# EAGLE design Copter_Receiver (EAGLE 7.5.0)
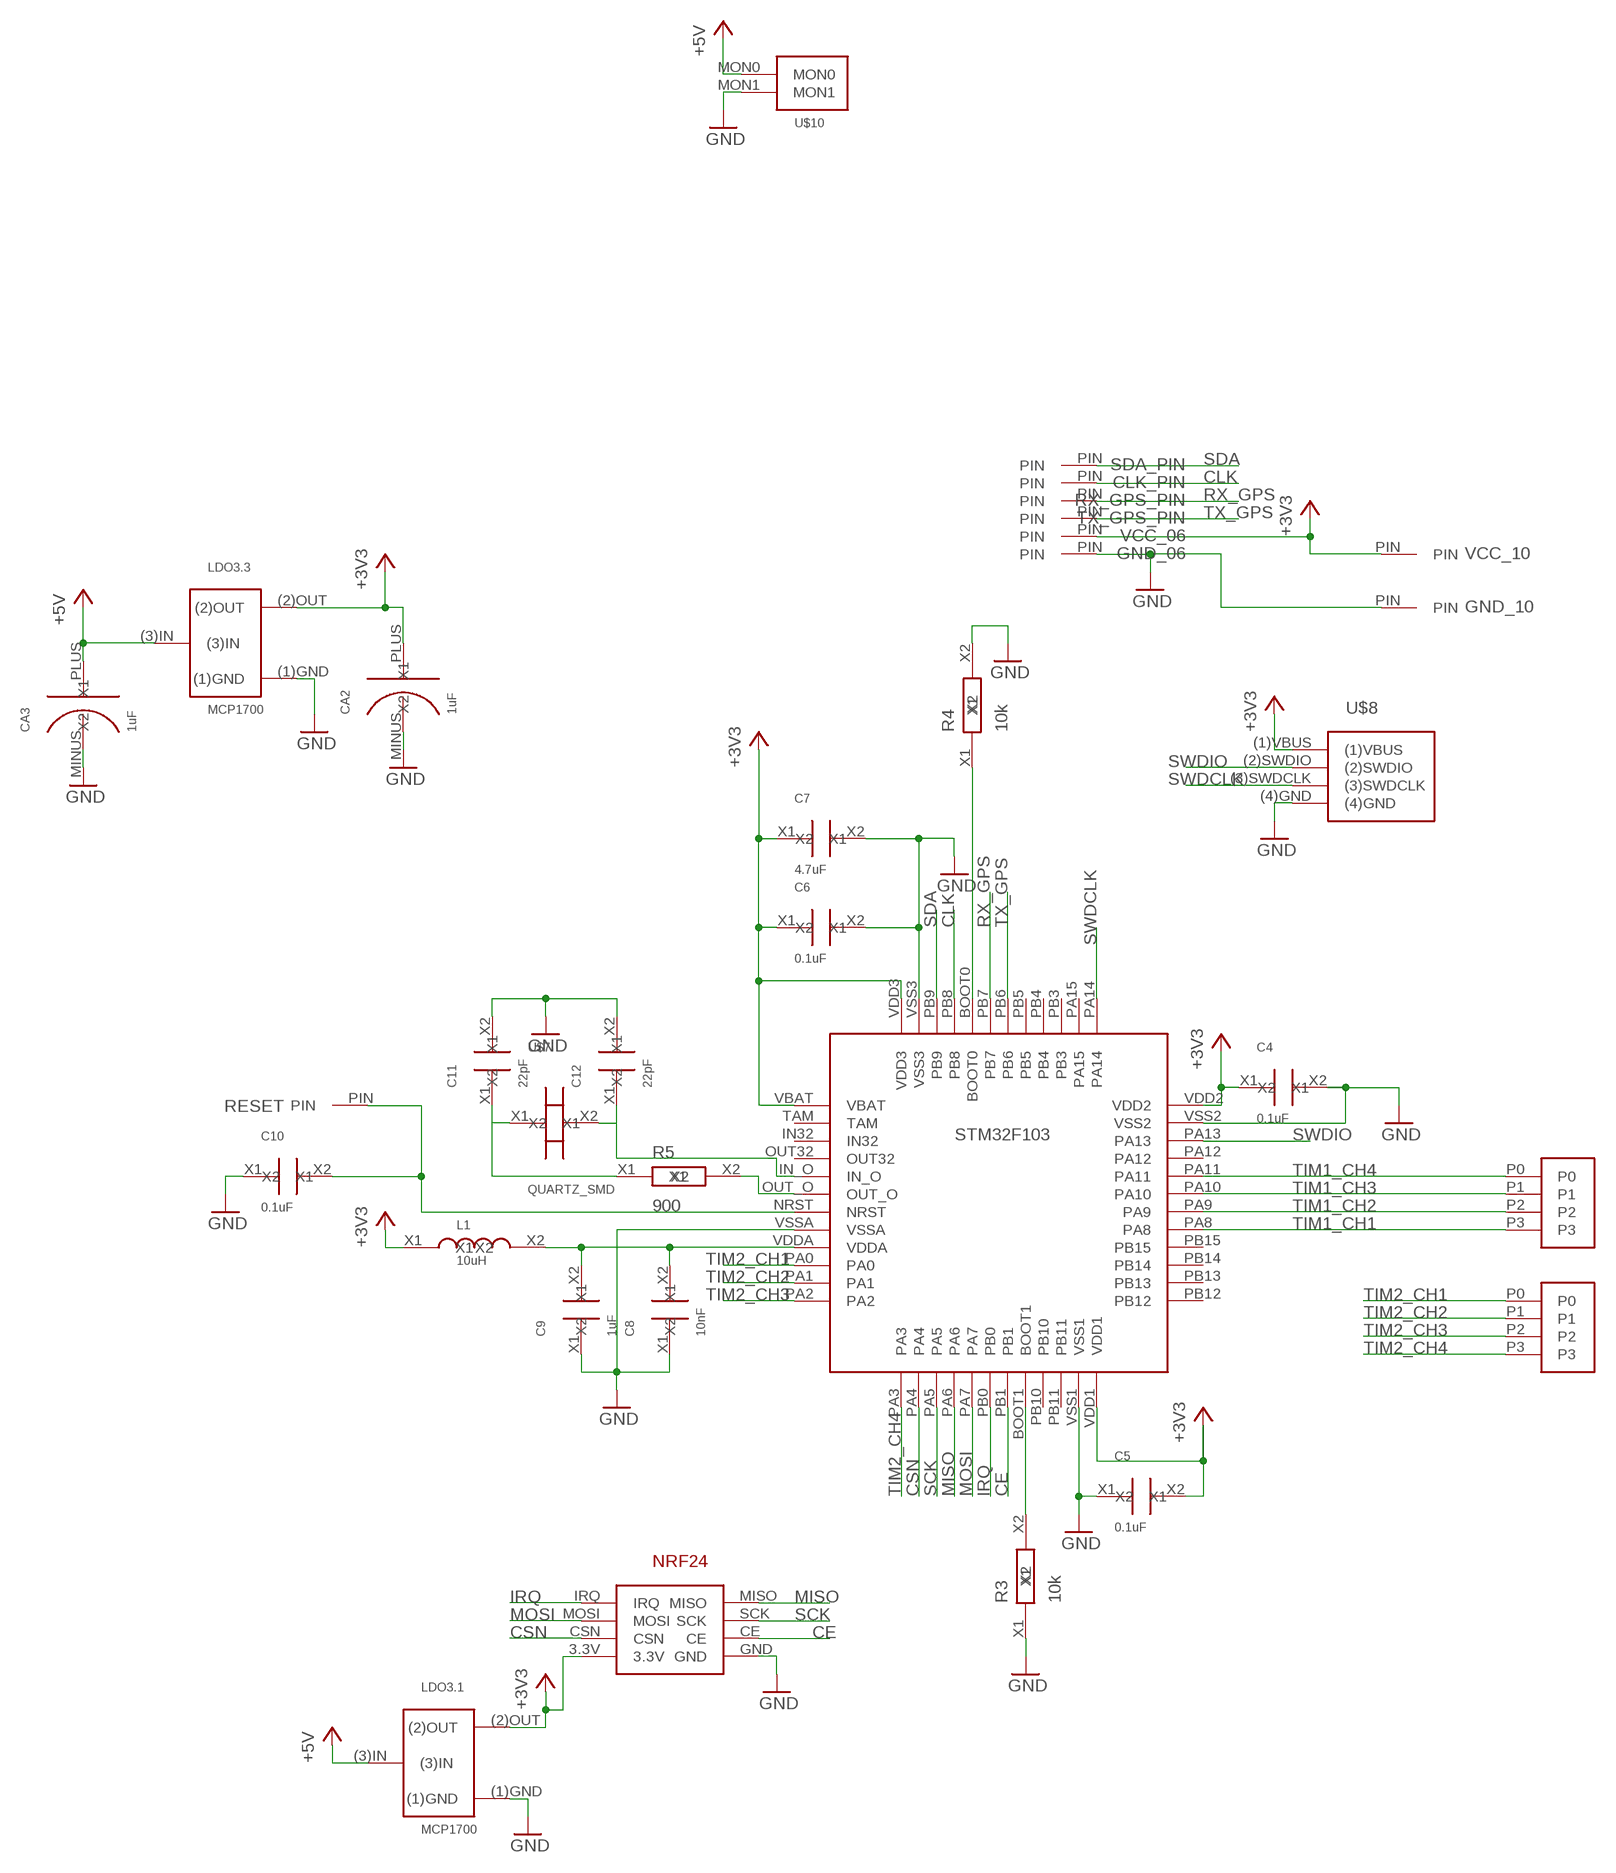
[diagram p0: schematic, sheet 1]

## Parts
C4  0.1uF  C_SMD_2.1X1.25  [SMD_2.1X1.25]
C5  0.1uF  C_SMD_2.1X1.25  [SMD_2.1X1.25]
C6  0.1uF  C_SMD_2.1X1.25  [SMD_2.1X1.25]
C7  4.7uF  C_SMD_2.1X1.25  [SMD_2.1X1.25]
C8  10nF  C_SMD_2.1X1.25  [SMD_2.1X1.25]
C9  1uF  C_SMD_2.1X1.25  [SMD_2.1X1.25]
C10  0.1uF  C_SMD_2.1X1.25  [SMD_2.1X1.25]
C11  22pF  C_SMD_2.1X1.25  [SMD_2.1X1.25]
C12  22pF  C_SMD_2.1X1.25  [SMD_2.1X1.25]
CA2  1uF  C_SMD_TA_A  [C_SMD_TA_A]
CA3  1uF  C_SMD_TA_A  [C_SMD_TA_A]
CLK_PIN  PIN_06  [PIN_06]
GND_06  PIN_06  [PIN_06]
GND_10  PIN  [PIN]
L1  10uH  L_SMD_2.1X1.25  [SMD_2.1X1.25]
LDO3.1  MCP1700  [MCP1700]
LDO3.3  MCP1700  [MCP1700]
R3  10k  R_SMD_2.1X1.25  [SMD_2.1X1.25]
R4  10k  R_SMD_2.1X1.25  [SMD_2.1X1.25]
R5  900  R_SMD_2.1X1.25  [SMD_2.1X1.25]
RESET  PIN  [PIN]
RX_GPS_PIN  PIN_06  [PIN_06]
SDA_PIN  PIN_06  [PIN_06]
STM32F103  STM32F103CBT6  [STM32F103CBT6]
TX_GPS_PIN  PIN_06  [PIN_06]
U$1  4PIN  [4PIN]
U$2  NRF24_PLUG  [NRF24_PLUG]
U$3  4PIN  [4PIN]
U$7  QUARTZ_SMD  [QUARTZ_SMD]
U$8  SWD  [SWD]
U$10  MON2PIN  [MON2PIN]
VCC_06  PIN_06  [PIN_06]
VCC_10  PIN  [PIN]

## Nets
+3V3: C4.X1 C5.X2 C6.X1 C7.X1 CA2.PLUS(X2) L1.X1 LDO3.1.(2)OUT LDO3.3.(2)OUT STM32F103.VBAT STM32F103.VDD1 STM32F103.VDD2 STM32F103.VDD3 U$2.3.3V U$8.(1)VBUS VCC_06.PIN VCC_10.PIN
+5V: CA3.PLUS(X2) LDO3.1.(3)IN LDO3.3.(3)IN U$10.MON0
CE: STM32F103.PB1 U$2.CE
CLK: CLK_PIN.PIN STM32F103.PB8
CSN: STM32F103.PA4 U$2.CSN
GND: C4.X2 C5.X1 C6.X2 C7.X2 C8.X1 C9.X1 C10.X1 C11.X2 C12.X2 CA2.MINUS(X1) CA3.MINUS(X1) GND_06.PIN GND_10.PIN LDO3.1.(1)GND LDO3.3.(1)GND R3.X1 R4.X2 STM32F103.VSS1 STM32F103.VSS2 STM32F103.VSS3 STM32F103.VSSA U$2.GND U$8.(4)GND U$10.MON1
IRQ: STM32F103.PB0 U$2.IRQ
MISO: STM32F103.PA6 U$2.MISO
MOSI: STM32F103.PA7 U$2.MOSI
N$2: R3.X2 STM32F103.BOOT1
N$5: R4.X1 STM32F103.BOOT0
N$6: R5.X2 STM32F103.OUT_O
N$7: C11.X1 R5.X1 U$7.X1
N$8: C12.X1 STM32F103.IN_O U$7.X2
N$9: C8.X2 C9.X2 L1.X2 STM32F103.VDDA
N$11: C10.X2 RESET.PIN STM32F103.NRST
RX_GPS: RX_GPS_PIN.PIN STM32F103.PB7
SCK: STM32F103.PA5 U$2.SCK
SDA: SDA_PIN.PIN STM32F103.PB9
SWDCLK: STM32F103.PA14 U$8.(3)SWDCLK
SWDIO: STM32F103.PA13 U$8.(2)SWDIO
TIM1_CH1: STM32F103.PA8 U$1.P3
TIM1_CH2: STM32F103.PA9 U$1.P2
TIM1_CH3: STM32F103.PA10 U$1.P1
TIM1_CH4: STM32F103.PA11 U$1.P0
TIM2_CH1: STM32F103.PA0 U$3.P0
TIM2_CH2: STM32F103.PA1 U$3.P1
TIM2_CH3: STM32F103.PA2 U$3.P2
TIM2_CH4: STM32F103.PA3 U$3.P3
TX_GPS: STM32F103.PB6 TX_GPS_PIN.PIN
Unconnected: STM32F103.IN32 STM32F103.OUT32 STM32F103.PA12 STM32F103.PA15 STM32F103.PB3 STM32F103.PB4 STM32F103.PB5 STM32F103.PB10 STM32F103.PB11 STM32F103.PB12 STM32F103.PB13 STM32F103.PB14 STM32F103.PB15 STM32F103.TAM

## Library data of the parts
C4-C12 = MyPowerComponents:C_SMD_2.1X1.25
CA2 CA3 = MyAmSys:C_SMD_TA_A
CLK_PIN GND_06 RX_GPS_PIN SDA_PIN TX_GPS_PIN VCC_06 = My_STM32:PIN_06
GND_10 RESET VCC_10 = MySTM32F103RGT6:PIN
L1 = MyPowerComponents:L_SMD_2.1X1.25
LDO3.1 LDO3.3 = MyCMOSsensor:MCP1700
R3-R5 = MyPowerComponents:R_SMD_2.1X1.25
STM32F103 = My_STM32:STM32F103CBT6
U$1 U$3 = My_STM32:4PIN
U$2 = My_flight:NRF24_PLUG
U$7 = MySTM32F103RGT6:QUARTZ_SMD
U$8 = MyCMOSsensor:SWD
U$10 = MyCMOSsensor:MON2PIN

## Board
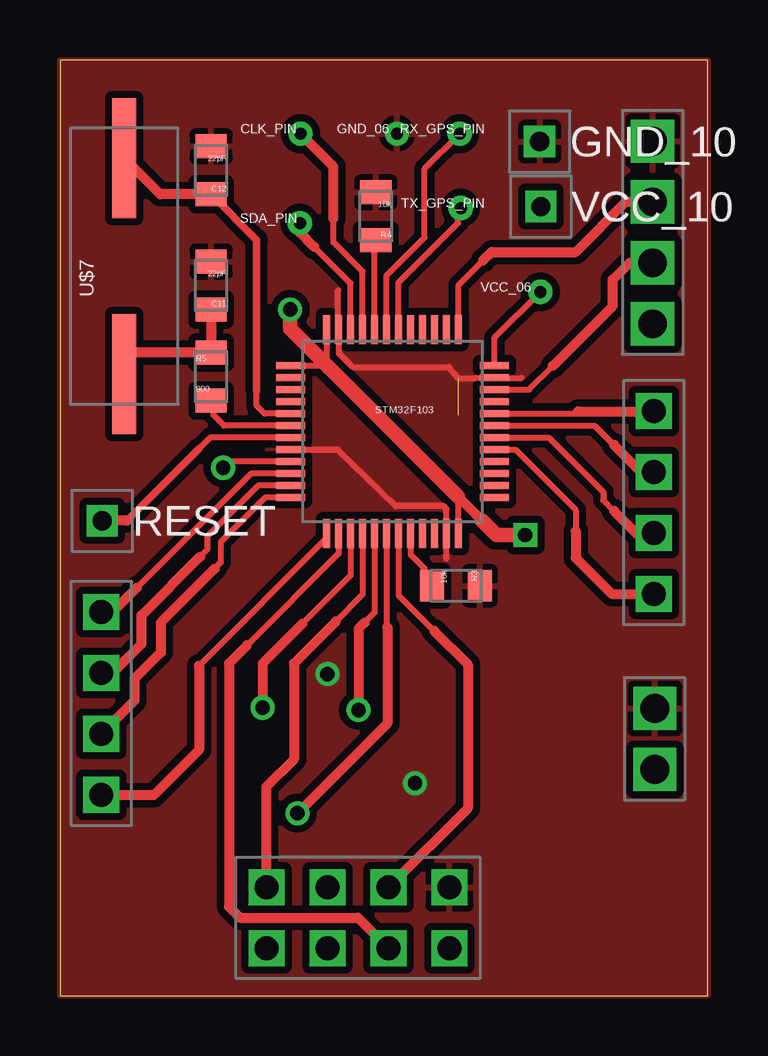
[diagram p1: board, top side]
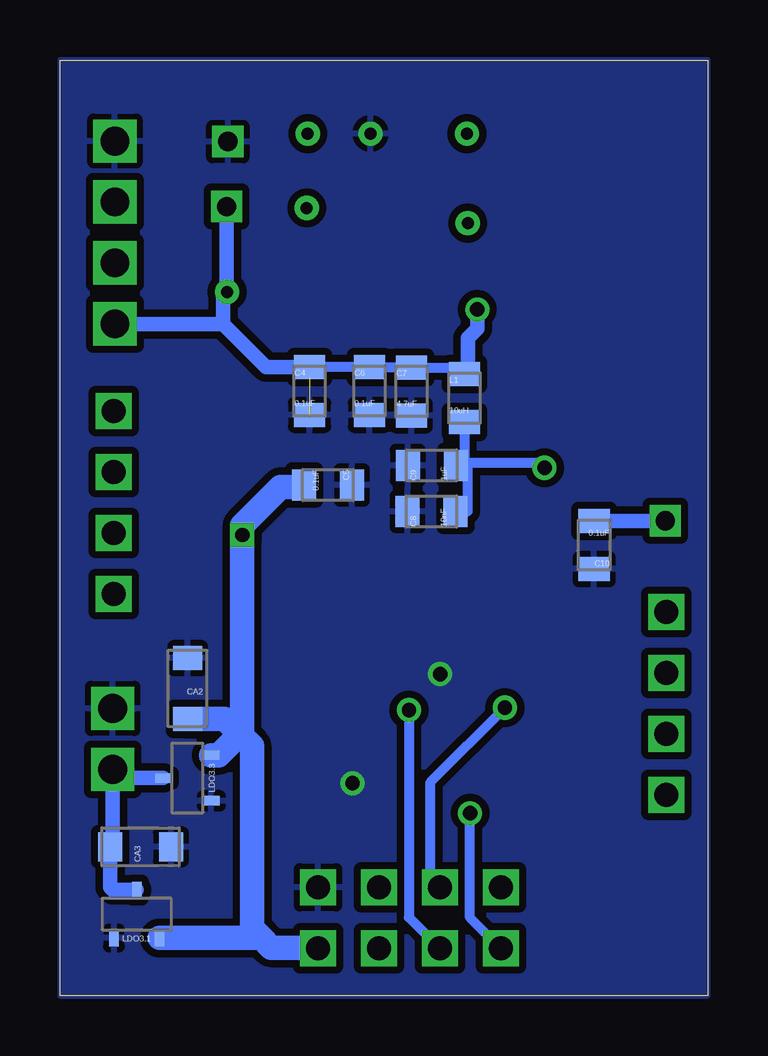
[diagram p2: board, bottom side, seen from below]

Size 27 x 39 mm. Coordinates in mm from the lower left corner, seen from the top.
Outline: 0,0 27,0 27,39 0,39 0,0
Copper layers (1*16): Top 0.035mm / dielectric 1.5mm / Bottom 0.035mm
Design rules "default *": minimum track width 10mil, minimum drill 24mil, track to track 8mil, track to pad 8mil, pad to pad 8mil, via to via 8mil, smd to smd 8mil, copper to edge 0mil, drill to drill 8mil, minimum pad ring 10mil, minimum via ring 8mil, stop-mask expansion 4mil, vias tented up to drill 0mil, thermal gap 10mil

### Footprints (pad centres in the part's own frame; a part is rotated, then mirrored left to right if it is on the bottom)
SMD_2.1X1.25 = smd 1.3 x 1: X1 0,1; X2 0,-1
C_SMD_TA_A = smd 1.2 x 1: MINUS 0,-1.27; PLUS 0,1.27
PIN_06 = drill 0.5: PIN 0,0
PIN = drill 0.8 square: PIN 0,0
MCP1700 = smd 0.4 x 0.7: (1)GND -0.95,-2; (2)OUT 0.95,-2; (3)IN 0,0
STM32F103CBT6 = smd 0.3 x 1.2: BOOT0 -0.75,4.25; BOOT1 0.75,-4.25; PA3 -2.75,-4.25; PA4 -2.25,-4.25; PA5 -1.75,-4.25; PA6 -1.25,-4.25; PA7 -0.75,-4.25; PA14 2.75,4.25; PA15 2.25,4.25; PB0 -0.25,-4.25; PB1 0.25,-4.25; PB3 1.75,4.25; PB4 1.25,4.25; PB5 0.75,4.25; PB6 0.25,4.25; PB7 -0.25,4.25; PB8 -1.25,4.25; PB9 -1.75,4.25; PB10 1.25,-4.25; PB11 1.75,-4.25; VDD1 2.75,-4.25; VDD3 -2.75,4.25; VSS1 2.25,-4.25; VSS3 -2.25,4.25 | smd 1.2 x 0.3: IN32 -4.25,1.75; IN_O -4.25,0.75; NRST -4.25,-0.25; OUT32 -4.25,1.25; OUT_O -4.25,0.25; PA0 -4.25,-1.75; PA1 -4.25,-2.25; PA2 -4.25,-2.75; PA8 4.25,-0.75; PA9 4.25,-0.25; PA10 4.25,0.25; PA11 4.25,0.75; PA12 4.25,1.25; PA13 4.25,1.75; PB12 4.25,-2.75; PB13 4.25,-2.25; PB14 4.25,-1.75; PB15 4.25,-1.25; TAM -4.25,2.25; VBAT -4.25,2.75; VDD2 4.25,2.75; VDDA -4.25,-1.25; VSS2 4.25,2.25; VSSA -4.25,-0.75
4PIN = drill 1 square: P0 0,2.54; P1 0,0; P2 0,-2.54; P3 0,-5.08
NRF24_PLUG = drill 1 square: 3.3V -1.27,-2.54; CE 1.27,0; CSN -1.27,0; GND 1.27,-2.54; IRQ -1.27,5.08; MISO 1.27,5.08; MOSI -1.27,2.54; SCK 1.27,2.54
QUARTZ_SMD = smd 5 x 1: X1 -4.5,0; X2 4.5,0
SWD = drill 1.2 square: (1)VBUS 0,5.08; (2)SWDIO 0,2.54; (3)SWDCLK 0,0; (4)GND 0,-2.54
MON2PIN = drill 1.2 square: MON0 0,2.54; MON1 0,0

### Placement (x,y rotation side)
C4  16.59,25.2 0 bottom
C5  15.83,21.28 270 bottom
C6  14.1,25.2 0 bottom
C7  12.35,25.18 0 bottom
C8  11.51,20.18 90 bottom
C9  11.5,22.1 90 bottom
C10  4.73,18.78 180 bottom
C11  6.3,29.6 180 top
C12  6.3,34.4 180 top
CA2  21.68,12.8 180 bottom
CA3  23.64,6.2 90 bottom
CLK_PIN  10.03,35.93 0 top
GND_06  14.05,35.93 0 top
GND_10  20,35.6 0 top
L1  10.13,24.9 0 bottom
LDO3.1  23.8,4.4 0 bottom
LDO3.3  22.69,9.07 90 bottom
R3  16.51,17.08 270 top
R4  13.17,32.48 180 top
R5  6.3,25.8 0 top
RESET  1.76,19.79 0 top
RX_GPS_PIN  16.67,35.93 0 top
SDA_PIN  10,32.2 0 top
STM32F103  13.87,23.51 0 top
TX_GPS_PIN  16.71,32.83 0 top
U$1  24.76,21.82 0 top
U$2  13.7,3.24 90 top
U$3  1.72,13.45 0 top
U$7  2.68,30.4 90 top
U$8  24.71,33.08 180 top
U$10  24.8,11.97 180 top
VCC_06  20.03,29.33 0 top
VCC_10  20.05,32.89 0 top

### Tracks (layer width: path | path; a pad name or v marks a point on that pad's centre or on a via)
+3V3  (via drill 0.6)
  Top 0.254: STM32F103.VDD2 18.12,27.42 VCC_06.PIN | 16.6,20.8 16.6,19.28 STM32F103.VDD1 | STM32F103.VDD3 11.12,26.28 11.14,26.26 STM32F103.VBAT 11.12,26.26 11.2,26.18
  Top 0.406: 16.6,20.8 17.6,19.8
  Top 0.61: 11.2,26.2 16.6,20.8 | 11.2,26.18 11.2,26.2 | 11.2,26.2 11.14,26.26 9.6,27.8 v9.6,28.6 | v19.4,19.2 18.2,19.2 17.6,19.8
  Bottom 0.406: C4.X1 C6.X1 14.1,26.18 C7.X1 10.13,26.18 L1.X1
  Bottom 0.61: v9.6,28.6 9.6,27.8 10,27.4 10,26.03 L1.X1 | C4.X1 18.4,26.2 20.2,28 | 20.2,28 20.2,29.16 VCC_06.PIN 20.05,29.35 VCC_10.PIN | U$8.(1)VBUS 20.2,28 | 19.4,19.6 19.4,19.4 19.2,19.2 19.2,19 v19.4,19.2
  Bottom 1.016: CA2.PLUS 20.13,11.53 19.5,10.9 | 19.5,10.9 19.4,10.8 | 19.4,10.8 19,10.4 19,2.8 18.6,2.4 | 18.6,2.4 18.2,2 16.27,2 U$2.3.3V | LDO3.1.(2)OUT 18.6,2.4 | LDO3.3.(2)OUT 20.38,10.02 19.5,10.9 | 19.4,10.8 v19.4,19.2 19.4,19.6 17.8,21.2 16.91,21.2 C5.X2
+5V
  Bottom 0.61: LDO3.3.(3)IN 24.44,9.07 U$10.MON0 24.8,6.31 CA3.PLUS 24.91,4.51 24.8,4.4 LDO3.1.(3)IN
CE
  Top 0.254: STM32F103.PB1 14.12,16.68 15.6,15.2
  Top 0.406: 15.6,15.2 17,13.8 17,7.81 U$2.CE
CLK
  Top 0.254: STM32F103.PB8 12.62,30.18 11.4,31.4 11.4,32.4
  Top 0.406: 11.4,32.4 11.4,34.56 CLK_PIN.PIN
CSN
  Top 0.254: STM32F103.PA4 11.62,18.42 7.8,14.6
  Top 0.406: 7.8,14.6 7.05,13.85 7.05,3.7 7.5,3.25 12.42,3.25 U$2.CSN
GND  (via drill 0.6)  (1 unrouted)
  Top 0.254: STM32F103.VSS1 16.12,20.28 16,20.4 14,20.4 11.6,22.75 9.66,22.75 STM32F103.VSSA | 16.1,19 16.1,18.2 | 11.6,29.4 11.6,27.78 STM32F103.VSS3 11.62,26.78 12.2,26.2 16.2,26.2 16.6,25.75 17.33,25.75 STM32F103.VSS2 18.3,25.75 | 18.05,25.75 18.3,25.75 | 18.3,25.75 19.25,25.75
  other vias: 14.8,8.85 11.15,13.4
  pour Bottom (isolate 0.305): 0,39 27,39 27,0 0,0
  pour Top (isolate 0.305): 0,39 27,39 27,0 0,0
IRQ  (via drill 0.6)
  Top 0.254: STM32F103.PB0 13.62,15.38 13.65,15.35
  Top 0.406: 13.65,15.35 13.65,11.35 v9.9,7.6
  Bottom 0.406: U$2.IRQ 9.9,3.25 v9.9,7.6
MISO
  Top 0.254: STM32F103.PA6 12.62,16.72 11.5,15.6
  Top 0.406: 11.5,15.6 9.75,13.85 9.75,9.85 8.6,8.7 8.6,4.53 U$2.MISO
MOSI  (via drill 0.6)
  Top 0.254: STM32F103.PA7 13.12,15.97 12.7,15.55
  Top 0.406: 12.7,15.55 12.45,15.3 v12.45,11.9
  Bottom 0.406: v12.45,11.9 12.45,3.26 U$2.MOSI
N$2
  Top 0.254: STM32F103.BOOT1 14.62,18.38 15.2,17.8 15.2,17.39 R3.X2
N$5
  Top 0.254: STM32F103.BOOT0 13.12,31.43 R4.X1
N$6
  Top 0.254: STM32F103.OUT_O 6.84,23.76 6.4,24.2 6.4,24.7 R5.X2
N$7
  Top 0.406: C11.X1 R5.X1 2.6,26.8 2.6,25.98 U$7.X1
N$8
  Top 0.254: STM32F103.IN_O 8.54,24.26 8.2,24.6 8.2,25.2
  Top 0.305: 8.2,25.2 8.2,31.5 C12.X1
  Top 0.406: C12.X1 4.18,33.4 U$7.X2
N$9  (via drill 0.6)
  Top 0.254: STM32F103.VDDA 7.06,22.26 v6.8,22
  Bottom 0.254: v6.8,22 7,22.2
  Bottom 0.406: C8.X2 10,20.18 10,22 10.5,22 C9.X2 | L1.X2 10.13,22.47 C9.X2 | 7,22.2 10.4,22.2 C9.X2
N$11
  Top 0.254: STM32F103.NRST 6.26,23.26 5.8,22.8
  Top 0.305: 5.8,22.8 2.8,19.8
  Top 0.406: 2.8,19.8 RESET.PIN
  Bottom 0.61: C10.X2 RESET.PIN
RX_GPS
  Top 0.254: STM32F103.PB7 13.62,30.02 15.2,31.6 15.2,34.46 RX_GPS_PIN.PIN
SCK  (via drill 0.6)
  Top 0.254: STM32F103.PA5 12.12,17.52 10.1,15.5
  Top 0.406: 10.1,15.5 8.45,13.85 v8.45,12
  Bottom 0.406: U$2.SCK 11.55,4.9 11.55,8.9 v8.45,12
SDA
  Top 0.254: STM32F103.PB9 12.12,29.68 10.6,31.2
  Top 0.406: 10.6,31.2 10,31.8 SDA_PIN.PIN
SWDCLK
  Top 0.254: STM32F103.PA14 16.62,29.62 17.65,30.65
  Top 0.406: 17.65,30.65 18,31 21.5,31 23.6,33.1 24.69,33.1 U$8.(3)SWDCLK
SWDIO
  Top 0.254: STM32F103.PA13 19.56,25.26 20.55,26.25
  Top 0.406: 20.55,26.25 23.05,28.75 23.05,29.85 23.75,30.55 U$8.(2)SWDIO
TIM1_CH1
  Top 0.254: STM32F103.PA8 18.99,22.76 21.5,20.25 21.5,19.35
  Top 0.406: 21.5,19.35 21.5,18.25 23,16.75 U$1.P3
TIM1_CH2
  Top 0.254: STM32F103.PA9 20.39,23.26 22.65,21 22.65,20.65 23.1,20.2
  Top 0.406: 23.1,20.2 24.05,19.25 24.73,19.25 U$1.P2
TIM1_CH3
  Top 0.254: STM32F103.PA10 22.29,23.76 23.1,22.95
  Top 0.406: 23.1,22.95 24.2,21.85 24.73,21.85 U$1.P1
TIM1_CH4
  Top 0.254: STM32F103.PA11 21.51,24.26 21.6,24.35
  Top 0.406: 21.6,24.35 U$1.P0
TIM2_CH1
  Top 0.254: STM32F103.PA0 7.96,21.76 3.2,17
  Top 0.406: U$3.P0 2.19,15.99 3.2,17
TIM2_CH2
  Top 0.254: STM32F103.PA1 8.26,21.26 6.15,19.15 6.15,18.6 5.85,18.3
  Top 0.406: U$3.P1 2.2,13.45 3.4,14.65 3.4,15.85 5.85,18.3
TIM2_CH3
  Top 0.254: STM32F103.PA2 8.56,20.76 6.7,18.9 6.7,18.05 6.45,17.8
  Top 0.406: 6.45,17.8 4.2,15.55 4.2,14.3 3.1,13.2 3.1,12.29 U$3.P2
TIM2_CH4
  Top 0.254: STM32F103.PA3 11.12,19.07 5.8,13.75
  Top 0.406: 5.8,13.75 5.8,10.25 3.9,8.35 1.74,8.35 U$3.P3
TX_GPS
  Top 0.254: STM32F103.PB6 14.12,29.72 16.6,32.2 16.6,32.72 TX_GPS_PIN.PIN